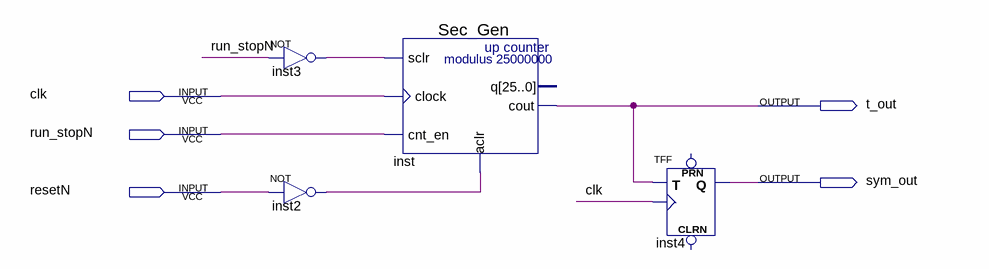
[diagram p0: schematic sheet]
// Quartus schematic Secgen.bdf as structural Verilog: 4 symbols, 5 pins
module Secgen (
  input  clk,
  input  run_stopN,
  input  resetN,
  output t_out,
  output sym_out
);

  wire inst2_out, inst3_out;

  not inst3 (inst3_out, run_stopN);
  not inst2 (inst2_out, resetN);
  Sec_Gen inst (.sclr(inst3_out), .clock(clk), .cnt_en(run_stopN), .aclr(inst2_out), .cout(t_out));  // open: q
  TFF inst4 (.T(t_out), .CLK(clk), .Q(sym_out));  // open: PRN, CLRN
endmodule
